# Altium schematic sheet Microcontrolador.SchDoc: Microcontrolador
size A4; DrawnBy: João Bortolace; Revision: 1.0; SheetNumber: 4; SheetTotal: 6
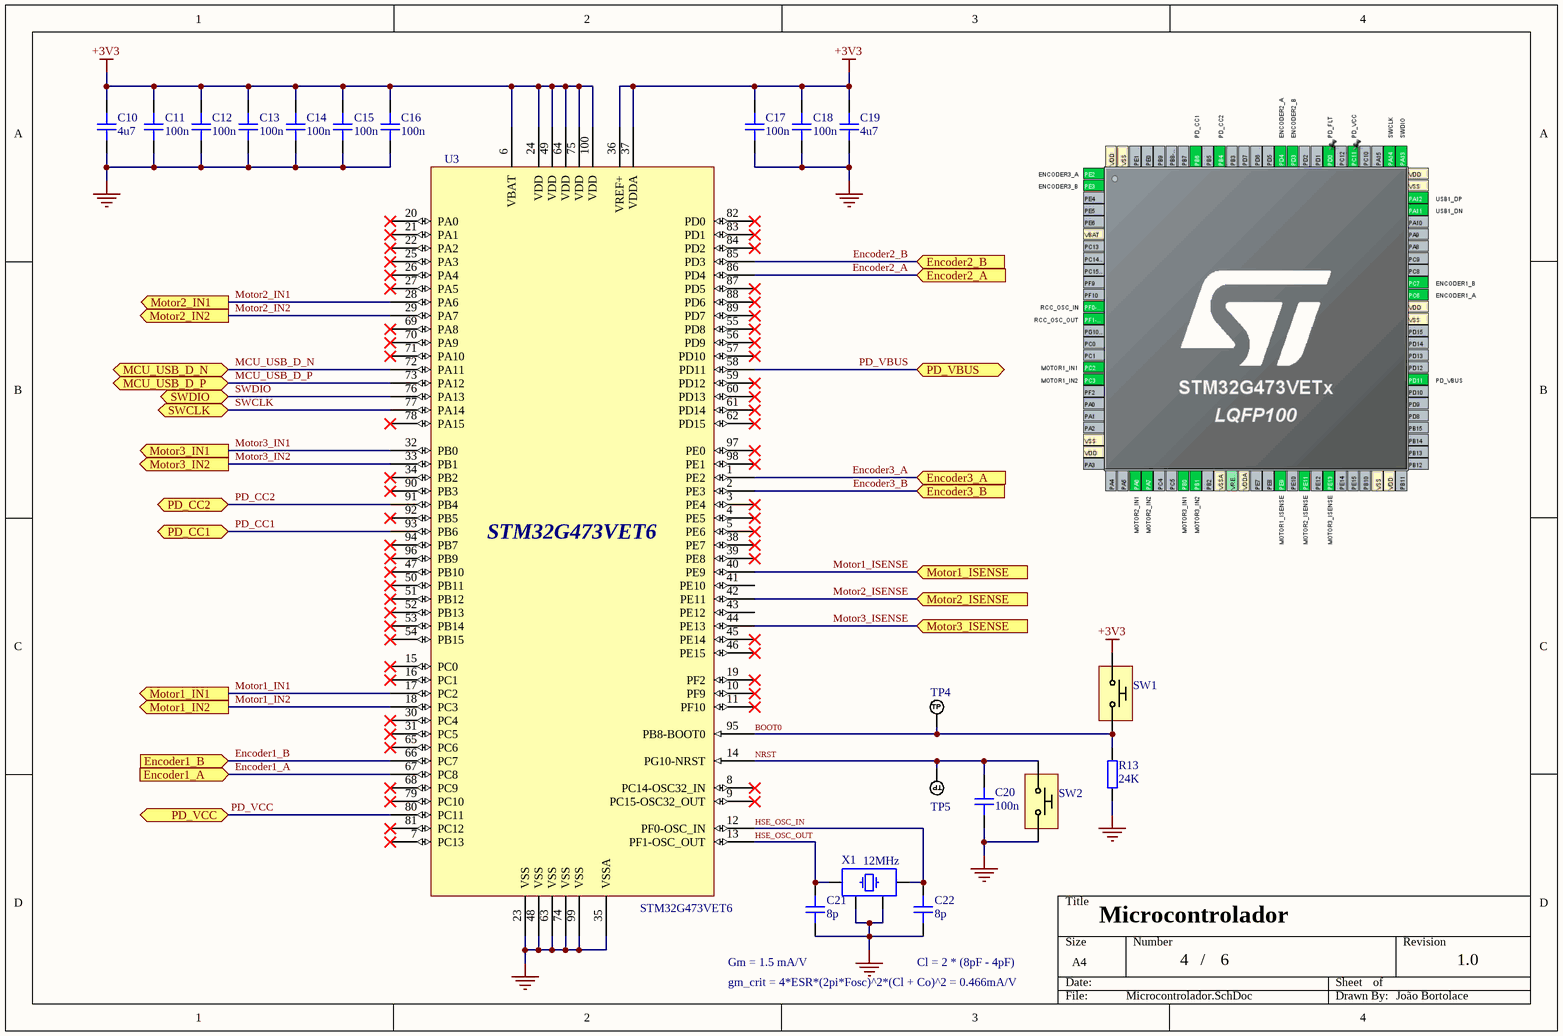
[diagram p0: Microcontrolador.SchDoc]

## Parts
C10  4u7  [CAP_0805]
C11  100n  [CAP_0402]
C12  100n  [CAP_0402]
C13  100n  [CAP_0402]
C14  100n  [CAP_0402]
C15  100n  [CAP_0402]
C16  100n  [CAP_0402]
C17  100n  [CAP_0402]
C18  100n  [CAP_0402]
C19  4u7  [CAP_0805]
C20  100n  [CAP_0402]
C21  8p  [CAP_0402]
C22  8p  [CAP_0402]
R13  24K  [RES_0402]
SW1  BOOT  [PTS815]  (value not drawn)
SW2  RST  [PTS815]  (value not drawn)
TP4  TP_NOBOM  [PAD_RND_1MM]  (value not drawn)  (no BOM)
TP5  TP_NOBOM  [PAD_RND_1MM]  (value not drawn)  (no BOM)
U3  STM32G473VET6  [LQFP100]
X1  12MHz  [XTAL_3225]

## Ports
Encoder1_A (in, see Esquemático Principal[2C], Conectores[1C]), Encoder1_B (in, see Esquemático Principal[2C], Conectores[1D]), Encoder2_A (in, see Esquemático Principal[2C], Conectores[2C]), Encoder2_B (in, see Esquemático Principal[2C], Conectores[2D]), Encoder3_A (in, see Esquemático Principal[2C], Conectores[3C]), Encoder3_B (in, see Esquemático Principal[2C], Conectores[3D]), MCU_USB_D_N (bidir, see Esquemático Principal[2C], Conectores[3B]), MCU_USB_D_P (bidir, see Esquemático Principal[2C], Conectores[3B]), Motor1_IN1 (out, see Esquemático Principal[3B]), Motor1_IN2 (out, see Esquemático Principal[3B]), Motor1_ISENSE (in, see Esquemático Principal[3B]), Motor2_IN1 (out, see Esquemático Principal[3B]), Motor2_IN2 (out, see Esquemático Principal[3B]), Motor2_ISENSE (in, see Esquemático Principal[3B]), Motor3_IN1 (out, see Esquemático Principal[3C]), Motor3_IN2 (out, see Esquemático Principal[3C]), Motor3_ISENSE (in, see Esquemático Principal[3C]), PD_CC1 (bidir, see Esquemático Principal[2B], Alimentação[4B]), PD_CC2 (bidir, see Esquemático Principal[2B], Alimentação[4B]), PD_VBUS (bidir, see Esquemático Principal[2B], Alimentação[4B]), PD_VCC (bidir, see Esquemático Principal[2B], Alimentação[4B]), SWCLK (bidir, see Esquemático Principal[2C], Conectores[3B]), SWDIO (bidir, see Esquemático Principal[2C], Conectores[3B])

## Nets
+3V3: C10.2 C11.2 C12.2 C13.2 C14.2 C15.2 C16.2 C17.2 C18.2 C19.2 SW1.1 U3.6(VBAT) U3.24(VDD) U3.36(VREF+) U3.37(VDDA) U3.49(VDD) U3.64(VDD) U3.75(VDD) U3.100(VDD)
GND: C10.1 C11.1 C12.1 C13.1 C14.1 C15.1 C16.1 C17.1 C18.1 C19.1 C20.1 C21.1 C22.1 R13.1 SW2.2 U3.23(VSS) U3.35(VSSA) U3.48(VSS) U3.63(VSS) U3.74(VSS) U3.99(VSS) X1.2 X1.4
BOOT0: R13.2 SW1.2 TP4.1(TP) U3.95(PB8-BOOT0)
Encoder1_A: U3.67(PC8) ; port Encoder1_A
Encoder1_B: U3.66(PC7) ; port Encoder1_B
Encoder2_A: U3.86(PD4) ; port Encoder2_A
Encoder2_B: U3.85(PD3) ; port Encoder2_B
Encoder3_A: U3.1(PE2) ; port Encoder3_A
Encoder3_B: U3.2(PE3) ; port Encoder3_B
HSE_OSC_IN: C22.2 U3.12(PF0-OSC_IN) X1.3
HSE_OSC_OUT: C21.2 U3.13(PF1-OSC_OUT) X1.1
MCU_USB_D_N: U3.72(PA11) ; port MCU_USB_D_N
MCU_USB_D_P: U3.73(PA12) ; port MCU_USB_D_P
Motor1_IN1: U3.17(PC2) ; port Motor1_IN1
Motor1_IN2: U3.18(PC3) ; port Motor1_IN2
Motor1_ISENSE: U3.40(PE9) ; port Motor1_ISENSE
Motor2_IN1: U3.28(PA6) ; port Motor2_IN1
Motor2_IN2: U3.29(PA7) ; port Motor2_IN2
Motor2_ISENSE: U3.42(PE11) ; port Motor2_ISENSE
Motor3_IN1: U3.32(PB0) ; port Motor3_IN1
Motor3_IN2: U3.33(PB1) ; port Motor3_IN2
Motor3_ISENSE: U3.44(PE13) ; port Motor3_ISENSE
NRST: C20.2 SW2.1 TP5.1(TP) U3.14(PG10-NRST)
PD_CC1: U3.93(PB6) ; port PD_CC1
PD_CC2: U3.91(PB4) ; port PD_CC2
PD_VBUS: U3.58(PD11) ; port PD_VBUS
PD_VCC: U3.80(PC11) ; port PD_VCC
SWCLK: U3.77(PA14) ; port SWCLK
SWDIO: U3.76(PA13) ; port SWDIO

Not connected (* = marked no-connect by the designer): U3 3(PE4)* 4(PE5)* 5(PE6)* 7(PC13)* 8(PC14-OSC32_IN)* 9(PC15-OSC32_OUT)* 10(PF9)* 11(PF10)* 15(PC0)* 16(PC1)* 19(PF2)* 20(PA0)* 21(PA1)* 22(PA2)* 25(PA3)* 26(PA4)* 27(PA5)* 30(PC4)* 31(PC5)* 34(PB2)* 38(PE7)* 39(PE8)* 41(PE10) 43(PE12) 45(PE14)* 46(PE15)* 47(PB10)* 50(PB11)* 51(PB12)* 52(PB13)* 53(PB14)* 54(PB15)* 55(PD8)* 56(PD9)* 57(PD10)* 59(PD12)* 60(PD13)* 61(PD14)* 62(PD15)* 65(PC6)* 68(PC9)* 69(PA8)* 70(PA9)* 71(PA10)* 78(PA15)* 79(PC10)* 81(PC12)* 82(PD0)* 83(PD1)* 84(PD2)* 87(PD5)* 88(PD6)* 89(PD7)* 90(PB3)* 92(PB5)* 94(PB7)* 96(PB9)* 97(PE0)* 98(PE1)*

## Notes on the sheet
- gm_crit = 4*ESR*(2pi*Fosc)^2*(Cl + Co)^2 = 0.466mA/V
- (near C21) Gm = 1.5 mA/V
- (near C22) Cl = 2 * (8pF - 4pF)
- /

## Library data of the parts
C10 C19 = CAP_0805: 4.7uF ±10% 50V Ceramic Capacitor X5R 0805; Manufacturer: Samsung Electro-Mechanics; Manufacturer Part Number: CL21A475KBQNNNE; Distributor Link: https://www.lcsc.com/product-detail/C98192.html?s_z=n_capacitor%25204.7u; LCSC: C98192; Rating: *; Dielectric: *
C11-C18 C20 = CAP_0402: 100nF ±10% 50V Ceramic Capacitor X7R 0402D 0402; Manufacturer: muRata; Manufacturer Part Number: GRM155R71H104KE14D; Distributor Link: https://www.lcsc.com/product-detail/C77020.html; LCSC: C77020; Rating: *; Dielectric: *
  C17: Supplier: LCSC; Supplier Part Number: C730122
C21 C22 = CAP_0402: 8pF ±1% 50V Ceramic Capacitor C0G 0402; Manufacturer: muRata; Manufacturer Part Number: GCM1555C1H8R0FA16D; Distributor Link: https://www.lcsc.com/product-detail/C1864375.html?utm_source=octopart&utm_medium=cpc&utm_campaign=GCM1555C1H8R0FA16D; LCSC: C1864375; Rating: 50V; Dielectric: C0G
R13 = RES_0402: Resistor SMD 0402; Manufacturer: *; Manufacturer Part Number: *; Distributor Link: *; LCSC: *
SW1 SW2 = PTS815-SJM-250-SMTR-LFS: Tactile Switch SPST 400gf 2.5mm 4.2mm x 3.2mm Surface Mount; Manufacturer: G-Switch; Manufacturer Part Number: GT-TC048D-H025-L1; LCSC: C843674
TP4 TP5 = TEST_POINT_RND_1MM: Test Point Round 1mm (NO BOM)
U3 = STM32G473VET6: Arm Cortex-M4 32-bit MCU+FPU, up to 512 KB Flash, 170 MHz / 213DMIPS, 128KB SRAM, rich analog, math accelerator; Manufacturer: STMicroelectronics; Manufacturer Part Number: STM32G473VET6; Part Link: https://www.lcsc.com/product-detail/C730122.html?s_z=n_C730122; LCSC: C730122; Supplier: Avnet; Supplier Part Number: STM32G473VET6
X1 = TSX-3225_24.0000MF15X-AC: Crystal 12MHz ±15ppm 8pF 120Ω SMD3225-4P; Manufacturer: DIODES; Manufacturer Part Number: FL1200138; LCSC: C526612; Part Link: https://www.lcsc.com/product-detail/C526612.html?s_z=n_Crystal%252012MHz%2520%25C2%25B110ppm%25208pF%2520120%25CE%25A9%2520SMD3225-4P; Supplier: LCSC; Supplier Part Number: C730122